# EAGLE design stellariscope (EAGLE 6.3)
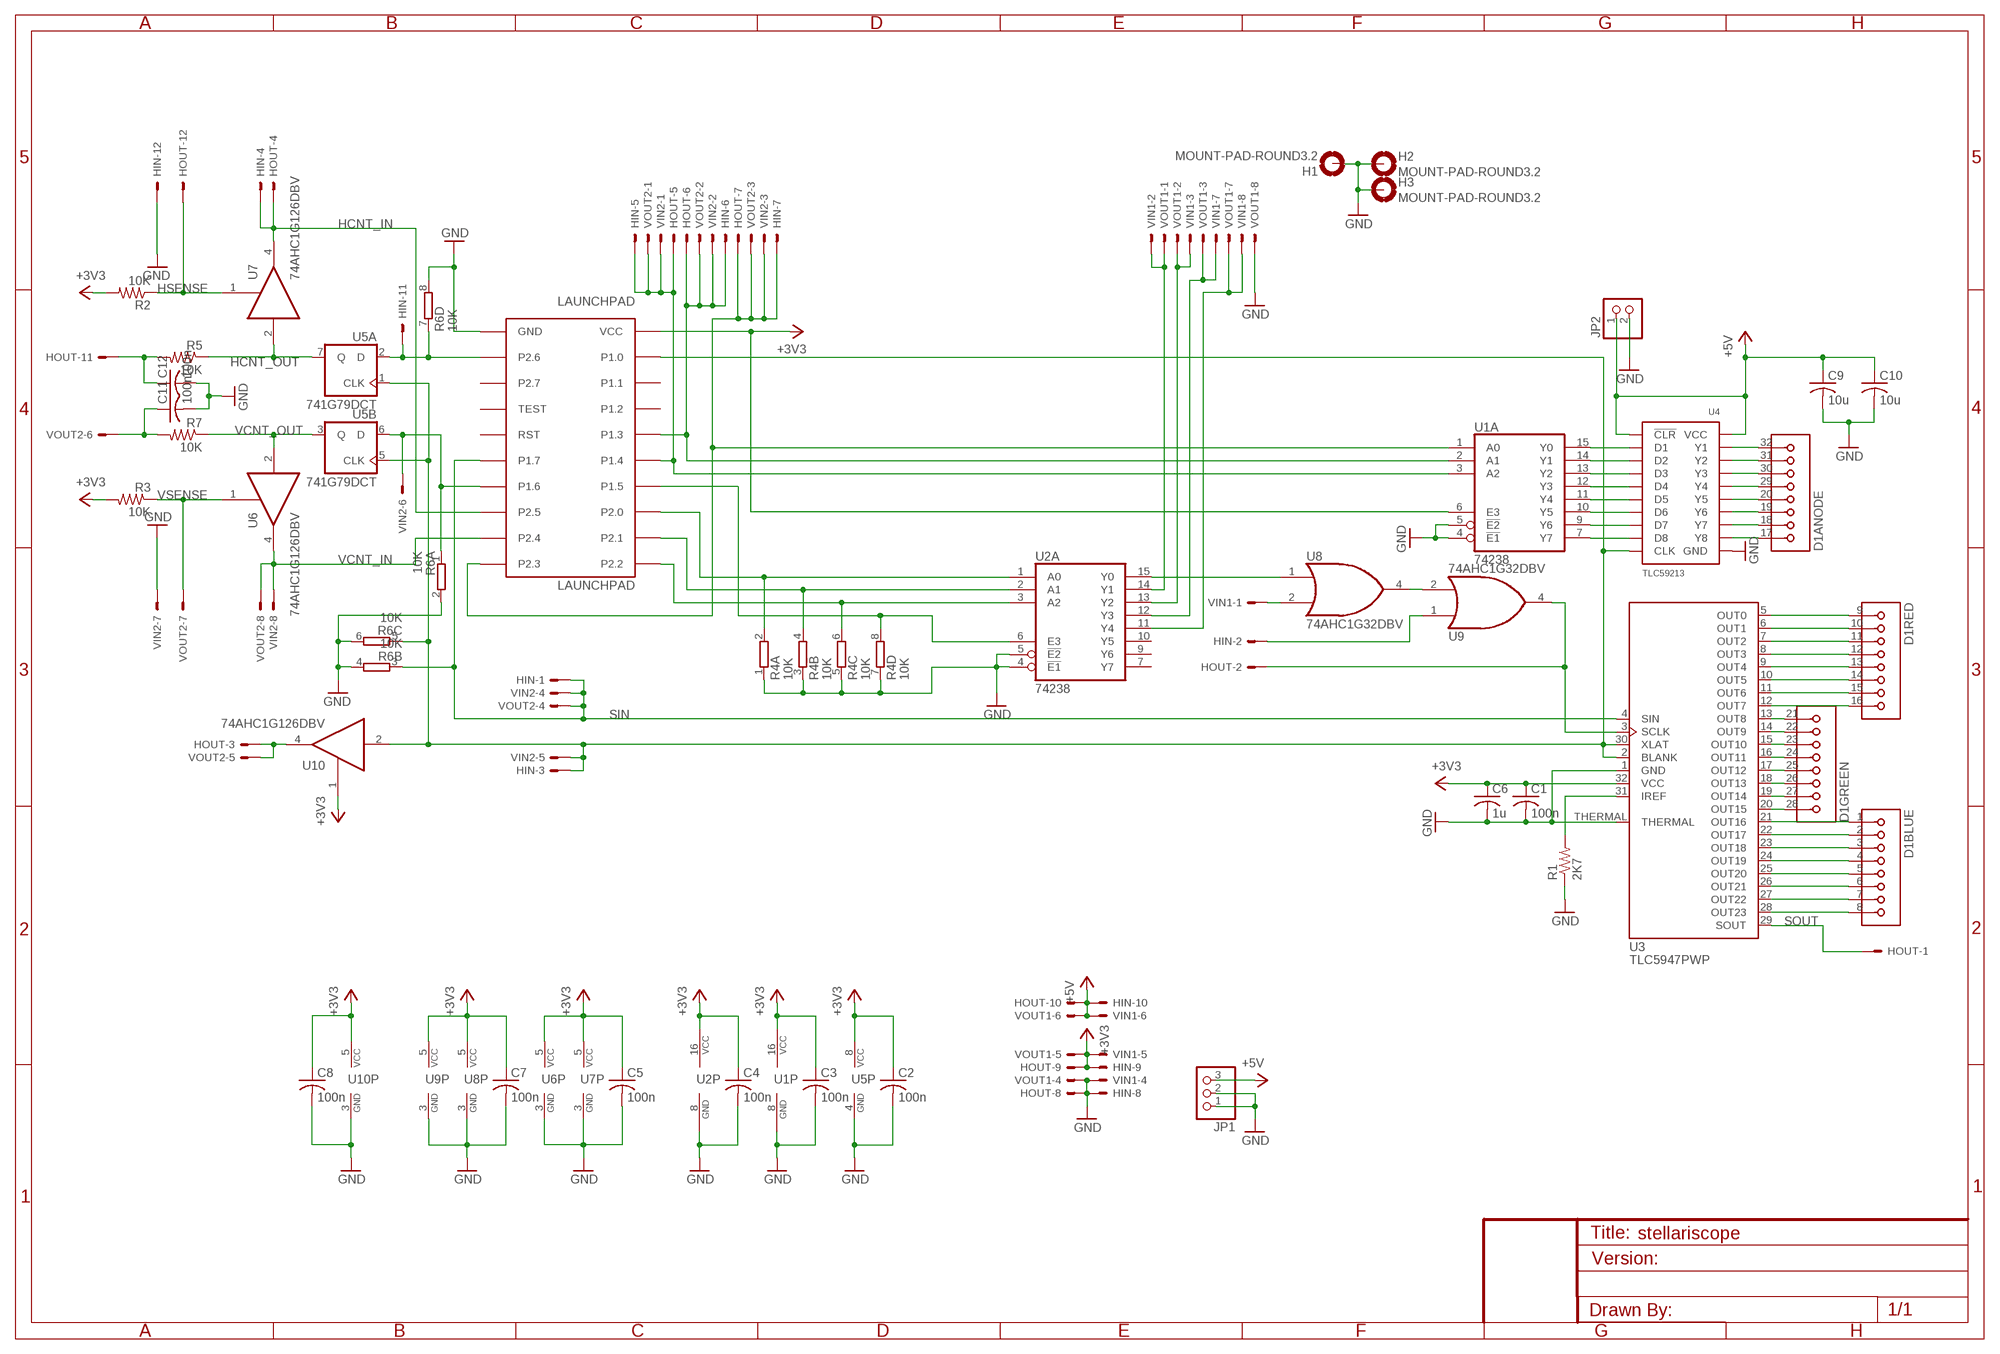
[diagram p0: schematic, sheet 1]

## Parts
C1  100n  C-USC0603  [C0603]
C2  100n  C-USC0603  [C0603]
C3  100n  C-USC0603  [C0603]
C4  100n  C-USC0603  [C0603]
C5  100n  C-USC0603  [C0603]
C6  1u  C-USC0603  [C0603]
C7  100n  C-USC0603  [C0603]
C8  100n  C-USC0603  [C0603]
C9  10u  C-USC1210  [C1210]
C10  10u  C-USC1210  [C1210]
C11  100n  C-USC0603  [C0603]
C12  100n  C-USC0603  [C0603]
D1  60MM-8X8-RGB-LED-ARRAY  [60MM-8X8-RGB-MATRIX]
H1  MOUNT-PAD-ROUND3.2  [3,2-PAD]
H2  MOUNT-PAD-ROUND3.2  [3,2-PAD]
H3  MOUNT-PAD-ROUND3.2  [3,2-PAD]
HIN  87760-121  [87760-121]
HOUT  87264-125  [87264-125]
JP1  PINHD-1X3  [1X03]
JP2  PINHD-1X2_2.54-90°  [1X02/90]
LAUNCHPAD  LAUNCHPAD  [LAUNCHPAD]
R1  2K7  R-US_R0603  [R0603]
R2  10K  R-US_R0603  [R0603]
R3  10K  R-US_R0603  [R0603]
R4  10K  4R-NCTS742C083  [CTS742C083-RES]
R5  10K  R-US_R0603  [R0603]
R6  10K  4R-NCTS742C083  [CTS742C083-RES]
R7  10K  R-US_R0603  [R0603]
U1  74238  [TSSOP16]
U2  74238  [TSSOP16]
U3  TLC5947PWP  [HTSSOP32-PWP]
U4  TLC59213  [TSSOP20]
U5  741G79DCT  [DCT_R-PDSO-G8]
U6  74AHC1G126DBV  [SOT23-5]
U7  74AHC1G126DBV  [SOT23-5]
U8  74AHC1G32DBV  [SOT23-5]
U9  74AHC1G32DBV  [SOT23-5]
U10  74AHC1G126DBV  [SOT23-5]
VIN1  87760-081  [87760-081]
VIN2  87760-081  [87760-081]
VOUT1  87264-085  [87264-085]
VOUT2  87264-085  [87264-085]

## Nets
+3V3: C1.1 C2.1 C3.1 C4.1 C5.1 C6.1 C7.1 C8.1 HIN.10 HOUT.9 LAUNCHPAD.VCC R2.2 R3.2 U1.6(A:E3) U1.16(P:VCC) U2.16(P:VCC) U3.32(VCC) U5.8(P:VCC) U6.5(VCC) U7.5(VCC) U8.5(VCC) U9.5(VCC) U10.1(OE) U10.5(VCC) VIN1.5 VOUT1.5
+5V: C9.1 C10.1 HIN.9 HOUT.10 JP1.3 JP2.1 U4.1(!CLR!) U4.20(VCC) VIN1.6 VOUT1.6
D1: U1.15(A:Y0) U4.2(D1)
D2: U1.14(A:Y1) U4.3(D2)
D3: U1.13(A:Y2) U4.4(D3)
D4: U1.12(A:Y3) U4.5(D4)
D5: U1.11(A:Y4) U4.6(D5)
D6: U1.10(A:Y5) U4.7(D6)
D7: U1.9(A:Y6) U4.8(D7)
D8: U1.7(A:Y7) U4.9(D8)
GND: C1.2 C2.2 C3.2 C4.2 C5.2 C6.2 C7.2 C8.2 C9.2 C10.2 C11.2 C12.2 H1.B3,2(MOUNT) H2.B3,2(MOUNT) H3.B3,2(MOUNT) HIN.8 HIN.12 HOUT.8 JP1.1 JP1.2 JP2.2 LAUNCHPAD.GND R1.1 R4.1 R4.3 R4.5 R4.7 R6.2 R6.4 R6.6 R6.8 U1.4(A:!E1!) U1.5(A:!E2!) U1.8(P:GND) U2.4(A:!E1!) U2.5(A:!E2!) U2.8(P:GND) U3.1(GND) U3.THERMAL U4.11(GND) U5.4(P:GND) U6.3(GND) U7.3(GND) U8.3(GND) U9.3(GND) U10.3(GND) VIN1.4 VIN2.7 VOUT1.4 VOUT1.8
HCNT_IN: HIN.4 HOUT.4 LAUNCHPAD.P2.5 U7.4(O)
HCNT_OUT: R5.1 U5.7(A:Q) U7.2(I)
HSENSE: HOUT.12 R2.1 U7.1(OE)
N$1: D1.9 U3.5(OUT0)
N$2: D1.10 U3.6(OUT1)
N$3: D1.11 U3.7(OUT2)
N$4: D1.12 U3.8(OUT3)
N$5: D1.13 U3.9(OUT4)
N$6: D1.14 U3.10(OUT5)
N$7: D1.15 U3.11(OUT6)
N$8: D1.16 U3.12(OUT7)
N$9: D1.28 U3.20(OUT15)
N$10: D1.27 U3.19(OUT14)
N$11: D1.26 U3.18(OUT13)
N$12: D1.25 U3.17(OUT12)
N$13: D1.24 U3.16(OUT11)
N$14: D1.23 U3.15(OUT10)
N$15: D1.22 U3.14(OUT9)
N$16: D1.21 U3.13(OUT8)
N$17: D1.1 U3.21(OUT16)
N$18: D1.2 U3.22(OUT17)
N$19: D1.3 U3.23(OUT18)
N$20: D1.4 U3.24(OUT19)
N$21: D1.5 U3.25(OUT20)
N$22: D1.6 U3.26(OUT21)
N$23: D1.7 U3.27(OUT22)
N$24: D1.8 U3.28(OUT23)
N$25: HIN.2 U9.1(I0)
N$26: R1.2 U3.31(IREF)
N$27: U2.12(A:Y3) VIN1.7 VOUT1.3
N$28: C12.1 HOUT.11 R5.2
N$29: LAUNCHPAD.P1.5 R4.8 U2.6(A:E3)
N$30: U2.15(A:Y0) U8.1(I0)
N$31: LAUNCHPAD.P2.0 R4.2 U2.1(A:A0)
N$32: LAUNCHPAD.P2.1 R4.4 U2.2(A:A1)
N$33: LAUNCHPAD.P2.2 R4.6 U2.3(A:A2)
N$34: HIN.5 HOUT.5 LAUNCHPAD.P1.4 U1.3(A:A2) VIN2.1 VOUT2.1
N$35: HIN.6 HOUT.6 LAUNCHPAD.P1.3 U1.2(A:A1) VIN2.2 VOUT2.2
N$36: HIN.7 HOUT.7 LAUNCHPAD.P2.3 U1.1(A:A0) VIN2.3 VOUT2.3
N$37: HIN.11 LAUNCHPAD.P2.6 R6.7 U5.2(A:D)
N$38: LAUNCHPAD.P1.6 R6.1 U5.6(B:D) VIN2.6
N$39: U2.14(A:Y1) VIN1.2 VOUT1.1
N$40: U2.13(A:Y2) VIN1.3 VOUT1.2
N$41: U2.11(A:Y4) VIN1.8 VOUT1.7
N$42: C11.1 R7.2 VOUT2.6
N$44: U8.2(I1) VIN1.1
N$47: U8.4(O) U9.2(I1)
N$48: HOUT.2 U3.3(SCLK) U9.4(O)
SIN: HIN.1 LAUNCHPAD.P1.7 R6.3 U3.4(SIN) VIN2.4 VOUT2.4
SOUT: HOUT.1 U3.29(SOUT)
VCNT_IN: LAUNCHPAD.P2.4 U6.4(O) VIN2.8 VOUT2.8
VCNT_OUT: R7.1 U5.3(B:Q) U6.2(I)
VSENSE: R3.1 U6.1(OE) VOUT2.7
XLAT: HIN.3 LAUNCHPAD.P1.0 R6.5 U3.2(BLANK) U3.30(XLAT) U4.10(CLK) U5.1(A:CLK) U5.5(B:CLK) U10.2(I) VIN2.5
XLAT_OUT: HOUT.3 U10.4(O) VOUT2.5
Y1: D1.32 U4.19(Y1)
Y2: D1.31 U4.18(Y2)
Y3: D1.30 U4.17(Y3)
Y4: D1.29 U4.16(Y4)
Y5: D1.20 U4.15(Y5)
Y6: D1.19 U4.14(Y6)
Y7: D1.18 U4.13(Y7)
Y8: D1.17 U4.12(Y8)
Unconnected: LAUNCHPAD.P1.1 LAUNCHPAD.P1.2 LAUNCHPAD.P2.7 LAUNCHPAD.RST LAUNCHPAD.TEST U2.7(A:Y7) U2.9(A:Y6) U2.10(A:Y5)

## Library data of the parts
C1-C5 C7 C8 C11 C12 = resistor:C-US: CAPACITOR, American symbol; PARTNO: CC0603KRX7R9BB104
C6 = resistor:C-US: CAPACITOR, American symbol; PARTNO: C1608X5R1E105M
C9 C10 = resistor:C-US: CAPACITOR, American symbol; PARTNO: C3216X5R1E106M
D1 = logos-diodes:60MM-8X8-RGB-LED-ARRAY; BOM: EXCLUDE; PARTNO: *
H1-H3 = holes:MOUNT-PAD-ROUND: MOUNTING PAD, round; BOM: EXCLUDE
HIN = con-milligrid:87760-121; PARTNO: 87760-121
HOUT = con-milligrid:87264-125; PARTNO: 87264-125
JP1 = pinhead:PINHD-1X3: PIN HEADER; DNP: T; PARTNO: *
JP2 = pinhead-1:PINHD-1X2: PIN HEADER; PARTNO: *
LAUNCHPAD = TI_launchpad:LAUNCHPAD: MSP-EXP430G2 LaunchPad Booster Pack layouts. LAUNCHPAD: Full-size board LAUNCHPAD-50MM: 50x50mm board covering the button area LAUNCHPAD-50MM-LEFT: 50x50mm board leaving the button area open. Tall LaunchPad components marked on Reference for reference.; BOM: EXCLUDE
R1 = resistor:R-US_: RESISTOR, American symbol; PARTNO: RMCF0603FT2K70
R2 R3 R5 R7 = resistor:R-US_: RESISTOR, American symbol; PARTNO: RMCF0603FT10K0
R4 R6 = res-cap-arrays:4R-N: Array Chip Resistor Source: RS Component / Phycomp; PARTNO: 742C083103JPTR
U1 U2 = ti-stuff:74*238; PARTNO: CD74HC238PWR
U3 = logos-led-drivers:TLC5947: 24-channel LED sink driver with dot correction and grayscale PWM Has internal 4 MHz internal PWM clock. 30mA sink capability Made by Texas Instruments Drawn by Pierce Nichols; PARTNO: TLC5947DAP
U4 = logos-led-drivers:TLC59213; PARTNO: TLC59213IPWR
U5 = 74xx-little-us:74*1G79: Single Positive-Edge-Triggered D-Type Flip-Flop Source: http://focus.ti.com/lit/ds/symlink/sn74lvc2g79.pdf; PARTNO: SN74LVC2G79DCTR
U6 U7 U10 = 74xx-little-us:74*1G126: Single Bus Buffer Gate With 3-State Outputs; PARTNO: SN74LVC1G126DBVR
U8 U9 = 74xx-little-us:74*1G32: 2-input OR gate; PARTNO: SN74LVC1G32QDBVRQ1
VIN1 VIN2 = con-milligrid:87760-081; PARTNO: 87760-081
VOUT1 VOUT2 = con-milligrid:87264-085; PARTNO: 87264-085

## Board
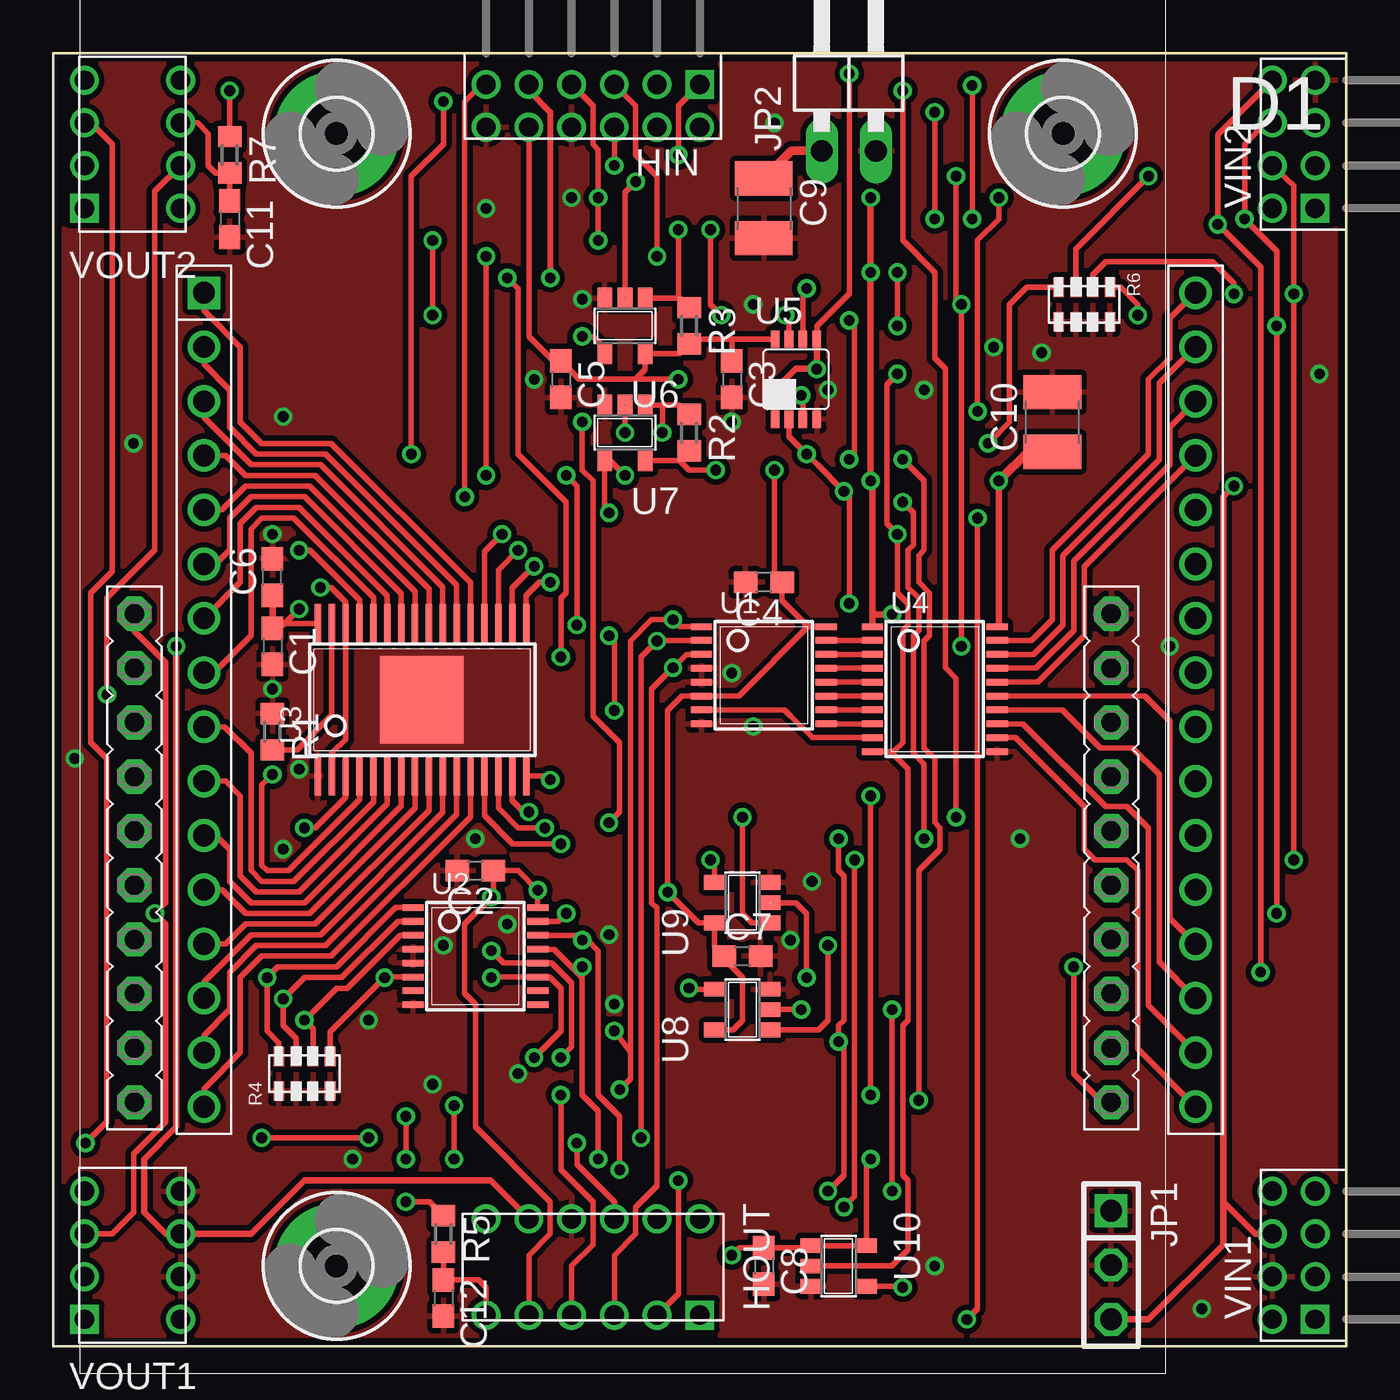
[diagram p1: board, top side]
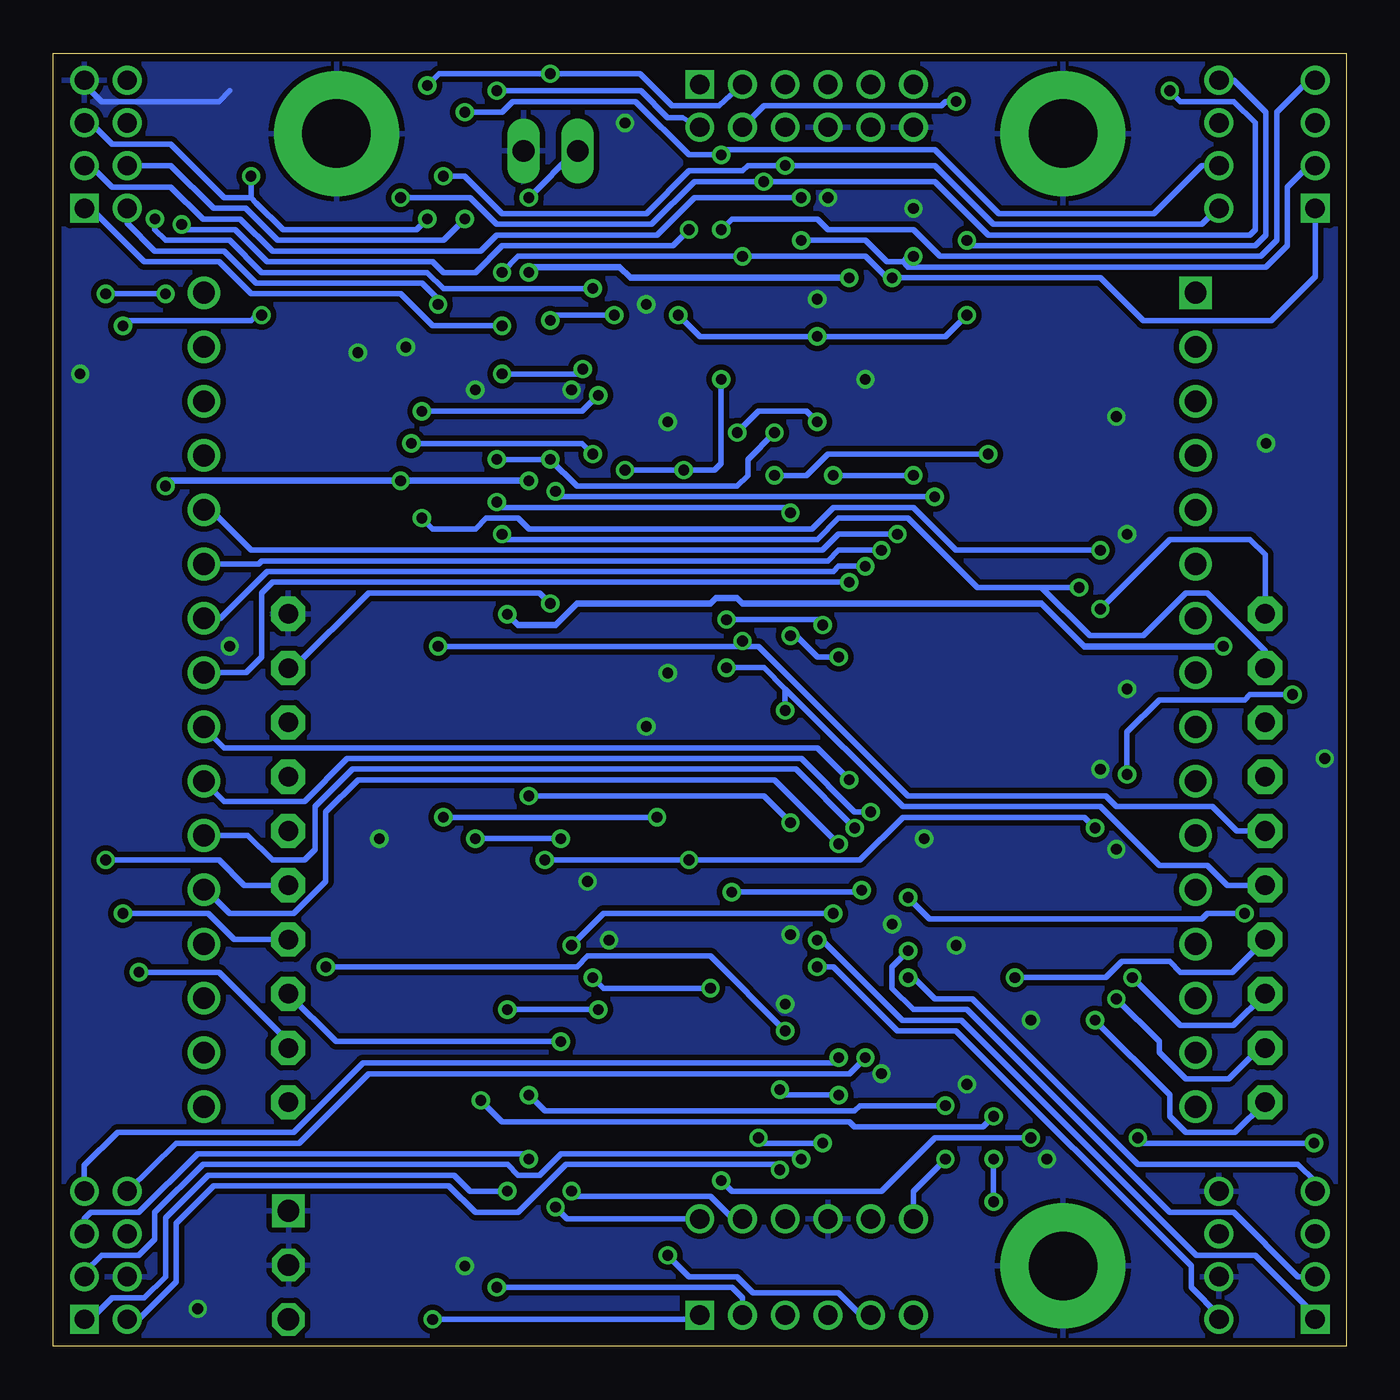
[diagram p2: board, bottom side, seen from below]

Size 60.5 x 60.5 mm. Coordinates in mm from the lower left corner, seen from the top.
Outline: 0,0 60.5,0 60.5,60.5 0,60.5 0,0
Copper layers (1*16): Top 0.0356mm / dielectric 1.5011mm / Bottom 0.0356mm
Design rules "LaenPCBOrder": minimum track width 6mil, minimum drill 13mil, track to track 6mil, track to pad 6mil, pad to pad 6mil, via to via 6mil, smd to smd 6mil, copper to edge 15mil, drill to drill 6mil, minimum pad ring 7mil, minimum via ring 7mil, stop-mask expansion 4mil, vias tented up to drill 0mil, thermal gap 10mil

### Footprints (pad centres in the part's own frame; a part is rotated, then mirrored left to right if it is on the bottom)
C0603 = smd 1.1 x 1: 1 -0.85,0; 2 0.85,0
C1210 = smd 1.6 x 2.7: 1 -1.4,0; 2 1.4,0
60MM-8X8-RGB-MATRIX = drill 1.016 square: 1 -23.2,19.05 | drill 1.016: 2 -23.2,16.51; 3 -23.2,13.97; 4 -23.2,11.43; 5 -23.2,8.89; 6 -23.2,6.35; 7 -23.2,3.81; 8 -23.2,1.27; 9 -23.2,-1.27; 10 -23.2,-3.81; 11 -23.2,-6.35; 12 -23.2,-8.89; 13 -23.2,-11.43; 14 -23.2,-13.97; 15 -23.2,-16.51; 16 -23.2,-19.05; 17 23.2,-19.05; 18 23.2,-16.51; 19 23.2,-13.97; 20 23.2,-11.43; 21 23.2,-8.89; 22 23.2,-6.35; 23 23.2,-3.81; 24 23.2,-1.27; 25 23.2,1.27; 26 23.2,3.81; 27 23.2,6.35; 28 23.2,8.89; 29 23.2,11.43; 30 23.2,13.97; 31 23.2,16.51; 32 23.2,19.05
3,2-PAD = drill 3.2 pad 5.842: B3,2 0,0
87760-121 = drill 0.9 square: 1 -1,5 | drill 0.9: 2 1,5; 3 -1,3; 4 1,3; 5 -1,1; 6 1,1; 7 -1,-1; 8 1,-1; 9 -1,-3; 10 1,-3; 11 -1,-5; 12 1,-5
87264-125 = drill 0.9 square: 1 2.25,5 | drill 0.9: 2 -2.25,5; 3 2.25,3; 4 -2.25,3; 5 2.25,1; 6 -2.25,1; 7 2.25,-1; 8 -2.25,-1; 9 2.25,-3; 10 -2.25,-3; 11 2.25,-5; 12 -2.25,-5
1X03 = drill 1.016 square: 1 -2.54,0 | drill 1.016 octagon: 2 0,0; 3 2.54,0
1X02/90 = drill 1.016 long: 1 -2.54,-3.81; 2 0,-3.81
LAUNCHPAD = drill 0.914 pad 1.6 octagon: GND 30.48,48.26; P1.0 33.02,2.54; P1.1 35.56,2.54; P1.2 38.1,2.54; P1.3 40.64,2.54; P1.4 43.18,2.54; P1.5 45.72,2.54; P1.6 45.72,48.26; P1.7 43.18,48.26; P2.0 48.26,2.54; P2.1 50.8,2.54; P2.2 53.34,2.54; P2.3 53.34,48.26; P2.4 50.8,48.26; P2.5 48.26,48.26; P2.6 33.02,48.26; P2.7 35.56,48.26; RST 40.64,48.26; TEST 38.1,48.26; VCC 30.48,2.54
R0603 = smd 1 x 1.1: 1 -0.85,0; 2 0.85,0
CTS742C083-RES = smd 0.9 x 0.5: 1 -0.8,1.2; 2 0.8,1.2; 3 -0.8,0.4; 4 0.8,0.4; 5 -0.8,-0.4; 6 0.8,-0.4; 7 -0.8,-1.2; 8 0.8,-1.2
TSSOP16 = smd 0.305 x 0.991: 1 -2.275,-2.918; 2 -1.625,-2.918; 3 -0.975,-2.918; 4 -0.325,-2.918; 5 0.325,-2.918; 6 0.975,-2.918; 7 1.625,-2.918; 8 2.275,-2.918; 9 2.275,2.918; 10 1.625,2.918; 11 0.975,2.918; 12 0.325,2.918; 13 -0.325,2.918; 14 -0.975,2.918; 15 -1.625,2.918; 16 -2.275,2.918
HTSSOP32-PWP = smd 0.3 x 1.8: 1 -4.875,-3.575; 2 -4.225,-3.575; 3 -3.575,-3.575; 4 -2.925,-3.575; 5 -2.275,-3.575; 6 -1.625,-3.575; 7 -0.975,-3.575; 8 -0.325,-3.575; 9 0.325,-3.575; 10 0.975,-3.575; 11 1.625,-3.575; 12 2.275,-3.575; 13 2.925,-3.575; 14 3.575,-3.575; 15 4.225,-3.575; 16 4.875,-3.575; 17 4.875,3.575; 18 4.225,3.575; 19 3.575,3.575; 20 2.925,3.575; 21 2.275,3.575; 22 1.625,3.575; 23 0.975,3.575; 24 0.325,3.575; 25 -0.325,3.575; 26 -0.975,3.575; 27 -1.625,3.575; 28 -2.275,3.575; 29 -2.925,3.575; 30 -3.575,3.575; 31 -4.225,3.575; 32 -4.875,3.575 | smd 3.91 x 4.11: THERMAL 0,0
TSSOP20 = smd 0.305 x 0.991: 1 -2.925,-2.918; 2 -2.275,-2.918; 3 -1.625,-2.918; 4 -0.975,-2.918; 5 -0.325,-2.918; 6 0.325,-2.918; 7 0.975,-2.918; 8 1.625,-2.918; 9 2.275,-2.918; 10 2.925,-2.918; 11 2.925,2.918; 12 2.275,2.918; 13 1.625,2.918; 14 0.975,2.918; 15 0.325,2.918; 16 -0.325,2.918; 17 -0.975,2.918; 18 -1.625,2.918; 19 -2.275,2.918; 20 -2.925,2.918
DCT_R-PDSO-G8 = smd 0.4 x 0.8: 1 -0.975,-1.875; 2 -0.325,-1.875; 3 0.325,-1.875; 4 0.975,-1.875; 5 0.975,1.875; 6 0.325,1.875; 7 -0.325,1.875; 8 -0.975,1.875
SOT23-5 = smd 0.69 x 0.99: 1 -0.95,-1.29; 2 0,-1.29; 3 0.95,-1.29; 4 0.95,1.3; 5 -0.95,1.3
87760-081 = drill 0.9 square: 1 -1,3 | drill 0.9: 2 1,3; 3 -1,1; 4 1,1; 5 -1,-1; 6 1,-1; 7 -1,-3; 8 1,-3
87264-085 = drill 0.9 square: 1 2.25,3 | drill 0.9: 2 -2.25,3; 3 2.25,1; 4 -2.25,1; 5 2.25,-1; 6 -2.25,-1; 7 2.25,-3; 8 -2.25,-3

### Placement (x,y rotation side)
C1  10.25,32.75 270 top
C2  19.75,22.25 180 top
C3  31.75,45.25 270 top
C4  33.25,35.75 180 top
C5  23.75,45.25 270 top
C6  10.25,36 90 top
C7  32.25,18.25 0 top
C8  33.25,3.75 270 top
C9  33.25,53.25 270 top
C10  46.75,43.25 90 top
C11  8.25,52.75 270 top
C12  18.25,2.25 270 top
D1  30.25,30.25 0 top
H1  13.25,56.75 0 top
H2  47.25,56.75 0 top
H3  13.25,3.75 0 top
HIN  25.25,58.05 270 top
HOUT  25.25,3.7 270 top
JP1  49.5,3.79 270 top
JP2  38.5,59.75 0 top
LAUNCHPAD  1.25,64.75 270 top
R1  10.25,28.75 270 top
R2  29.75,42.75 270 top
R3  29.75,47.75 270 top
R4  11.75,12.75 90 top
R5  18.25,5.25 270 top
R6  48.25,48.75 270 top
R7  8.25,55.75 270 top
U1  33.25,31.4 270 top
U2  19.75,18.25 270 top
U3  17.25,30.25 0 top
U4  41.25,30.75 270 top
U5  34.75,45.25 0 top
U6  26.75,47.75 180 top
U7  26.75,42.75 180 top
U8  32.25,15.75 90 top
U9  32.25,20.75 90 top
U10  36.75,3.75 270 top
VIN1  58.05,4.25 180 top
VIN2  58.05,56.25 180 top
VOUT1  3.7,4.25 180 top
VOUT2  3.7,56.25 180 top

### Tracks (layer width: path | path; a pad name or v marks a point on that pad's centre or on a via)
+3V3  (via drill 0.5)
  Top 0.254: v38.25,8.75 38.05,8.55 U10.5 U10.1 35.36,4.6 C8.1 32.1,4.6 v31.75,4.25 | U8.5 31.8,14.8 32.25,15.25 32.25,17.25 31.4,18.1 C7.1 30.95,18.7 U9.5 30.2,19.8 v28.75,21.25 28.75,29.75 29.43,30.43 U1.6 32.08,30.43 35.33,33.67 | U2.16 v22.67,21.33 21.75,22.25 C2.1 20.6,21.1 v20.5,21 19.25,19.75 19.25,16.5 19.75,16 19.75,10.25 23.25,6.75 23.25,5.25 22.25,4.25 HOUT.9 | LAUNCHPAD.VCC 3.79,33.46 5.25,32 5.25,20.75 v4.75,20.25 5.25,19.75 5.25,10.5 3.75,9 3.75,6.25 2.75,5.25 VOUT1.5 | HIN.10 22.25,47.25 23.4,46.1 C5.1 24.6,45.25 27.25,45.25 | 27.25,45.25 27.7,45.7 U6.5 29.3,46.45 R3.2 29.98,47.12 31.75,47.12 | U5.8 31.75,47.12 | C3.1 31.75,47.12 | U7.5 29.3,41.45 | 29.3,41.45 R2.2 | 35.33,33.67 34.1,34.9 C4.1 33.75,36.1 v33.75,41 | U1.16 35.33,33.67 | 27.25,45.25 v29.25,45.25 | 29.3,41.45 29.75,41 v31,41 | U3.32 10.47,33.83 C1.1 10.35,33.6 10.5,33.75 10.75,33.75 v11.5,34.5
  Top 0.305: C6.1 C1.1
  Bottom 0.254: VIN1.5 59.05,5.95 58.75,6.25 56.5,6.25 53.75,9 38.5,9 v38.25,8.75 | v4.75,20.25 6.5,20.25 6.75,20 19.5,20 v20.5,21 | v33.75,41 v31,41 29.55,41 29.25,41.3 v29.25,45.25 | v28.75,21.25 22.75,21.25 v22.67,21.33 | HOUT.9 22.7,1.45 23.75,2.5 27.75,2.5 28.5,3.25 30.75,3.25 v31.75,4.25 | v11.5,34.5 8.25,37.75 4.5,37.75 3.79,37.04 LAUNCHPAD.VCC
+5V  (via drill 0.5)
  Top 0.29: 23.25,57.75 v23.25,50
  Top 0.305: VIN1.6 56.25,5.25 54.75,6.75 | 54.75,6.75 54.75,39.75 v55.25,40.25 | v44.25,40.5 44.25,33.76 U4.20 | U4.1 38.33,34.25 | 38.33,34.25 38.33,40.42 v38.25,40.5 v38.25,50.25 v38.25,53.75 | v5.75,32.75 5.75,10.25 4.25,8.75 4.25,6.25 5.25,5.25 VOUT1.6 9.25,5.25 11.75,7.75 20.45,7.75 HOUT.10 | HIN.9 22.25,58.75 23.25,57.75 | v39.25,34.25 38.33,34.25 | JP1.3 51.25,1.25 54.75,4.75 54.75,6.75
  Top 0.406: 44.25,40.35 v44.25,40.5 45.6,41.85 C10.1 | JP2.1 34.54,55.94 C9.1
  Bottom 0.305: v55.25,40.25 55,40.5 v44.25,40.5 v38.25,40.5 | v5.75,32.75 12.25,32.75 14.25,34.75 28.25,34.75 28.5,35 29.5,35 29.75,34.75 36,34.75 37,33.75 38.75,33.75 v39.25,34.25 | v23.25,50 33.5,50 34,50.5 38,50.5 v38.25,50.25 | JP2.1 36.06,55.94 v38.25,53.75
D1
  Top 0.254: U1.15 U4.2
D2
  Top 0.254: U1.14 U4.3
D3
  Top 0.254: U1.13 U4.4
D4
  Top 0.254: U1.12 U4.5
D5
  Top 0.254: U1.11 U4.6
D6
  Top 0.254: U1.10 U4.7
D7
  Top 0.254: U1.9 U4.8
D8
  Top 0.254: U4.9 35.52,28.48 34.5,29.5 34.25,29.75 34.23,29.77 U1.7
GND  (via drill 0.5)
  Bottom 0.254: VIN2.7 59.05,59.05 58.25,58.25 52.75,58.25 52.25,58.75
  other vias: 10.25,38 10.25,30.75 1,27.5 19.75,23.75 34.5,19 11.5,27 24.75,49 36.25,44.75 22.5,45.25 20.25,53.25 24.25,53.75 10.75,23.25 10.75,43.5 26,19.25 35.5,21.75 31.75,43.25 3.75,42.25 31.75,31.5 32.75,29 14,8.75 14.75,15.25 17.75,12.25 21.75,12.75 21.25,19.75 18.25,18.75 53.75,1.75 52.25,32.75 45.25,23.75 26.25,16 59.25,45.5 46.25,46.5 41.25,3.75 32.75,48.75 33.75,57.25 40.75,44.75 44,46.75
  pour Top (isolate 0.254): 0.25,60.25 60.25,60.25 60.25,0.25 0.25,0.25
  pour Bottom (isolate 0.254): 0.25,60.25 60.25,60.25 60.25,0.25 0.25,0.25
HCNT_IN  (via drill 0.5)
  Top 0.254: v36.25,7.25 37,8 37,14 v36.75,14.25 36.75,15 37,15.25 37,22 36.75,22.25 v36.75,23.75 | v40.75,23.75 40.75,27.25 40.25,27.75 40.25,33.25 40.5,33.5 40.5,35 40,35.5 40,37.25 40.25,37.5 40.25,39 v39.75,39.5 | v26,39 25.8,39.2 U7.4 26.05,41.45 v26.75,40.75 | v16.75,41.75 16.75,54.75 18.25,56.25 v18.25,58.25
  Bottom 0.254: HOUT.4 28.7,5.95 29.75,7 36,7 v36.25,7.25 | v36.75,14.25 47.27,14.25 LAUNCHPAD.P2.5 | v36.75,23.75 v40.75,23.75 | v39.75,39.5 39.5,39.25 26.25,39.25 v26,39 | v26.75,40.75 25.25,40.75 24.25,41.75 v16.75,41.75 | v18.25,58.25 18.75,58.25 18.95,58.05 27.25,58.05 HIN.4
HCNT_OUT  (via drill 0.5)
  Top 0.254: v16.5,8.75 v16.5,10.75 | v40.5,11.5 40.5,22.25 41.5,23.25 41.5,24.25 41.25,24.5 41.25,27.5 40.75,28 40.75,33 41,33.25 41,35.25 40.5,35.75 40.5,37 40.75,37.25 40.75,40.5 v39.75,41.5 | v26.75,42.75 U7.2 | U5.7 34.42,48.08 v34.25,48.25 | v37.25,48 37.5,47.75 37.5,41.75 v37.25,41.5 | v16.5,6.75 17.6,6.75 R5.1
  Bottom 0.254: v16.5,6.75 v16.5,8.75 | v16.5,10.75 17,10.25 23,10.25 23.25,10.5 39.5,10.5 v40.5,11.5 | v39.75,41.5 v37.25,41.5 36,40.25 28.5,40.25 28,40.75 28,41.5 v26.75,42.75 | v34.25,48.25 37,48.25 v37.25,48
HSENSE  (via drill 0.5)
  Top 0.254: U7.1 28.5,44.04 | 28.5,44.04 29.31,44.04 R2.1 | v18.75,8.75 v18.75,11.25 | v38.25,11.75 v38.25,25.75 | v26,24.5 26.5,25 26.5,28.25 25.25,29.5 25.25,40.5 24.75,41 v24.75,43.25 | v28.5,42.75 28.5,44.04
  Bottom 0.254: HOUT.12 20.25,7.25 v18.75,8.75 | v18.75,11.25 22.75,11.25 23,11 37.5,11 v38.25,11.75 | v38.25,25.75 27.25,25.75 v26,24.5 | v24.75,43.25 25.25,43.75 27.5,43.75 v28.5,42.75
N$1
  Top 0.254: D1.9 8.02,28.98 9.25,27.75 9.25,22.25 9.75,21.75 11.25,21.75 14.97,25.48 U3.5
N$2
  Top 0.254: D1.10 8.06,26.44 8.75,25.75 8.75,22 9.5,21.25 11.5,21.25 15.62,25.38 U3.6
N$3
  Top 0.254: D1.11 7.6,23.9 8.25,23.25 8.25,21.75 9.25,20.75 11.75,20.75 16.27,25.27 U3.7
N$4
  Top 0.254: D1.12 7.89,21.36 9,20.25 12,20.25 16.93,25.18 U3.8
N$5
  Top 0.254: D1.13 8.07,18.82 9,19.75 12.25,19.75 17.57,25.07 U3.9
N$6
  Top 0.254: D1.14 7.05,17.05 9.25,19.25 12.5,19.25 18.23,24.98 U3.10
N$7
  Top 0.254: D1.15 7.05,14.55 8.25,15.75 8.25,17.5 9.5,18.75 12.75,18.75 18.88,24.88 U3.11
N$8
  Top 0.254: D1.16 7.05,12.05 8.75,13.75 8.75,17.25 9.75,18.25 13,18.25 19.52,24.77 U3.12
N$9  (via drill 0.5)
  Top 0.254: v21,38 20.18,37.17 U3.20
  Bottom 0.254: D1.28 53.14,39.14 51.25,37.25 24.5,37.25 23.75,38 v21,38
N$10  (via drill 0.5)
  Top 0.254: v21.75,37.25 20.82,36.33 U3.19
  Bottom 0.254: D1.27 50.9,36.6 50.75,36.75 24.25,36.75 23.75,37.25 v21.75,37.25
N$11  (via drill 0.5)
  Top 0.254: v22.5,36.5 21.48,35.48 U3.18
  Bottom 0.254: D1.26 52.69,34.06 50.5,36.25 24,36.25 23.75,36.5 v22.5,36.5
N$12  (via drill 0.5)
  Top 0.254: v23.25,35.75 22.75,35.75 22.12,35.12 U3.17
  Bottom 0.254: D1.25 51.48,31.52 50.75,32.25 50.75,35.25 50.25,35.75 v23.25,35.75
N$13  (via drill 0.5)
  Top 0.254: 23.12,26.62 v23.25,26.5 23.07,26.68 U3.16
  Bottom 0.254: D1.24 53.45,28.95 52.5,28 24.75,28 v23.25,26.5
N$14  (via drill 0.5)
  Top 0.254: v22.25,25 22,25 21.48,25.52 U3.15
  Bottom 0.254: D1.23 52.5,25.5 48.75,25.5 46.75,27.5 25.5,27.5 23,25 v22.25,25
N$15  (via drill 0.5)
  Top 0.254: v23,24.25 21.75,24.25 20.82,25.18 U3.14
  Bottom 0.254: D1.22 51.4,23.9 50.25,22.75 48.75,22.75 48.25,23.25 48.25,25.25 46.5,27 25.75,27 v23,24.25
N$16  (via drill 0.5)
  Top 0.254: v23.75,23.5 21.5,23.5 20.18,24.82 U3.13
  Bottom 0.254: D1.21 53.36,21.36 52.25,20.25 49.25,20.25 47.75,21.75 47.75,25 46.25,26.5 26.75,26.5 v23.75,23.5
N$17
  Top 0.254: D1.1 7.05,48.45 8.75,46.75 8.75,43.25 9.75,42.25 13,42.25 19.52,35.73 U3.21
N$18
  Top 0.254: D1.2 7.05,45.95 8.25,44.75 8.25,43 9.5,41.75 12.75,41.75 18.88,35.62 U3.22
N$19
  Top 0.254: D1.3 7.05,43.45 9.25,41.25 12.5,41.25 18.23,35.52 U3.23
N$20
  Top 0.254: D1.4 8.07,41.68 9,40.75 12.25,40.75 17.57,35.42 U3.24
N$21
  Top 0.254: D1.5 7.89,39.14 9,40.25 12,40.25 16.93,35.33 U3.25
N$22
  Top 0.254: D1.6 7.6,36.6 8.25,37.25 8.25,38.75 9.25,39.75 11.75,39.75 16.27,35.23 U3.26
N$23
  Top 0.254: D1.7 8.75,35.75 8.75,38.5 9.5,39.25 11.5,39.25 15.62,35.12 U3.27
N$24
  Top 0.254: D1.8 7.52,31.52 9.25,33.25 9.25,38.25 9.75,38.75 11.25,38.75 14.97,35.02 U3.28
N$25  (via drill 0.5)
  Top 0.254: U9.1 32.7,19.8 32.25,20.25 v32.25,24.75 | v42.25,24.75 42.25,31.25 41.75,31.75 41.75,45.75 41.25,46.25 41.25,50.25 39.75,51.75 v39.75,58.75
  Bottom 0.254: v32.25,24.75 v42.25,24.75 | HIN.2 31.05,57.5 31.75,57.5 33,58.75 v39.75,58.75
N$26
  Top 0.254: R1.2 11.4,27.9 13.03,29.52 U3.31
N$27  (via drill 0.5)
  Top 0.254: v20.5,18.5 21.07,17.93 U2.12 23.32,17.93 24.25,17 24.25,14 v23.75,13.5
  Bottom 0.254: VIN1.7 59.05,8.45 57.5,10 49.25,10 46,13.25 24,13.25 v23.75,13.5 | v20.5,18.5 21.25,17.75 21.25,16.75 20.25,15.75 17.75,15.75 8.25,6.25 5.25,6.25 2.25,3.25 VOUT1.3
N$28
  Top 0.254: R5.2 C12.1 19.9,3.1 20.25,2.75 HOUT.11
N$29  (via drill 0.5)
  Top 0.254: U2.6 15.53,17.27 v15.5,17.25 12.95,14.7 R4.8
  Bottom 0.254: v15.5,17.25 11.25,17.25 10.5,18 8.25,18 7.75,17.5 5.32,17.5 LAUNCHPAD.P1.5
N$30  (via drill 0.5)
  Top 0.254: U2.15 23.62,19.88 v24,20.25 | v36.25,18.75 36.25,15.25 35.8,14.8 U8.1
  Bottom 0.254: v24,20.25 34.75,20.25 v36.25,18.75
N$31  (via drill 0.5)
  Top 0.254: U2.1 16.02,20.52 13.25,17.75 10.5,17.75 v10,17.25 10,14.75 10.55,14.2 R4.2
  Bottom 0.254: v10,17.25 7.75,15 5.28,15 LAUNCHPAD.P2.0
N$32  (via drill 0.5)
  Top 0.254: U2.2 16.12,19.88 13.5,17.25 11.75,17.25 v10.75,16.25 10.75,15 11.35,14.4 R4.4
  Bottom 0.254: LAUNCHPAD.P2.1 4.05,13.95 5.5,12.5 7.5,12.5 8.75,13.75 8.75,14.25 v10.75,16.25
N$33  (via drill 0.5)
  Top 0.254: U2.3 16.23,19.23 13.75,16.75 13.25,16.75 v11.75,15.25 12.15,14.85 R4.6
  Bottom 0.254: v11.75,15.25 8.25,11.75 8.25,10.75 7.5,10 5.2,10 LAUNCHPAD.P2.2
N$34  (via drill 0.5)
  Top 0.254: U1.3 29.62,32.38 v29,31.75 28,30.75 28,20.75 28.25,20.5 28.25,7.5 27.25,6.5 27.25,5.25 26.25,4.25 HOUT.5 | v26.25,29.75 26.25,33 v26,33.25 | v23.75,32.25 23.75,35 24,35.25 24,39.5 21.75,41.75 21.75,49.5 v21.25,50 | v28.25,51 28.25,54.75 27.25,55.75 27.25,58.05 HIN.5 | v39.5,50.25 v39.5,47.75
  Bottom 0.254: VIN2.1 58.75,53.25 56.25,50.75 52.75,50.75 51.25,49.25 44.25,49.25 42.75,47.75 v39.5,47.75 | LAUNCHPAD.P1.4 5.57,21.57 6.5,22.5 8.75,22.5 11.5,25.25 20.75,25.25 26.25,30.75 | v29,31.75 27.25,31.75 26.25,30.75 | VOUT2.1 1.45,50.05 3.5,48 9.5,48 11.5,50 v21.25,50 21.5,50 22.5,51 v28.25,51 38.75,51 v39.5,50.25 | 26.25,30.75 v26.25,29.75 | v26,33.25 25.75,33.25 24.75,32.25 v23.75,32.25
N$35  (via drill 0.5)
  Top 0.254: U1.2 28.27,33.02 v28.25,33 27.5,32.25 v27.5,9.75 | HIN.6 v26.25,55.25 | v42.25,54.75 42.25,49 v42.5,48.75 v42.5,32.75 | HOUT.6 26.25,6.75 24.5,8.5 v24.5,9.5
  Bottom 0.254: VIN2.2 57.05,52.55 55.75,51.25 52.5,51.25 51,49.75 43.25,49.75 42.25,48.75 v42.5,48.75 | LAUNCHPAD.P1.3 5.11,24.11 6.25,25.25 10.75,25.25 11.25,25.75 20.5,25.75 27.5,32.75 28,32.75 v28.25,33 28.5,32.75 v42.5,32.75 | VOUT2.2 6,53.25 6.75,52.5 16.5,52.5 19.25,55.25 v26.25,55.25 28,55.25 28.25,55 30.75,55 32.75,53 39.5,53 41.25,54.75 v42.25,54.75 | v24.5,9.5 27.25,9.5 v27.5,9.75
N$36  (via drill 0.5)
  Top 0.254: v29,34 29.25,33.75 | U1.1 29.32,33.67 v29,34 | HOUT.7 24.25,3.75 25.25,4.75 25.25,6.75 23.75,8.25 v23.75,11.75 | v26.5,12 27,12.5 27,13.75 | 27,13.75 27,33 28,34 v29,34 | v24.5,33.75 24.5,40.25 v24,40.75 | HIN.7 25.25,58.05 25.25,56.25 25.5,56 v25.5,53.75 v25.5,51.75 | v20.25,40.75 v20.25,51 | LAUNCHPAD.P2.3 49.09,11.41 47.75,12.75 v47.75,17.75 | v26.25,14.75 27,13.75
  Bottom 0.254: VIN2.3 58.75,55.25 57.75,54.25 55,54.25 53.5,52.75 51.75,52.75 50.25,51.25 40.5,51.25 39.75,52 32.25,52 30.5,53.75 v25.5,53.75 | VOUT2.3 1.75,55.25 2.75,54.25 2.75,51.5 3.75,50.5 20.5,50.5 20.75,50.75 | v23.75,11.75 26.25,11.75 v26.5,12 | v24.5,33.75 24.75,34 v29,34 28,34 | 20.75,50.75 21.5,50.75 22.5,51.75 v25.5,51.75 | v24,40.75 v20.25,40.75 | v20.25,51 20.5,51 20.75,50.75 | v47.75,17.75 36,17.75 35.5,18.25 29.75,18.25 v26.25,14.75
N$37  (via drill 0.5)
  Top 0.254: v37.25,34.75 37.25,39.75 v37,40 35.75,41.25 v35.25,41.75 34.42,42.58 U5.2 | HIN.11 20.05,59.05 19.25,58.25 v19.25,39.75 | R6.7 45.55,49.55 44.75,48.75 44.75,43.25 v43.75,42.25
  Bottom 0.254: LAUNCHPAD.P2.6 49.27,31.73 45.75,35.25 37.75,35.25 v37.25,34.75 | v19.25,39.75 36.75,39.75 v37,40 | v43.75,42.25 35.75,42.25 v35.25,41.75
N$38  (via drill 0.5)
  Top 0.254: v57.25,20.25 v57.25,47.75 57.25,49.25 57.25,51.25 v55.75,52.75 55.75,56.25 56.75,57.25 VIN2.6 | U5.6 35.08,49.33 v35.25,49.5 | R6.1 49.95,49.55 50.75,48.75 v50.75,48.25
  Bottom 0.254: LAUNCHPAD.P1.6 52.03,19.03 53.25,20.25 v57.25,20.25 | v55.75,52.75 55.75,52.25 55.25,51.75 52.25,51.75 50.75,50.25 43,50.25 42.25,49.5 v35.25,49.5 | v50.75,48.25 51,48.25 51.25,48 57,48 v57.25,47.75
N$39  (via drill 0.5)
  Top 0.254: U2.14 24.52,19.23 v24.75,19 25,19 25.5,18.5 25.5,11.75 26.5,10.75 v26.5,8.25
  Bottom 0.254: VIN1.2 56.5,1.25 54.75,3 54.75,5.75 53,7.5 42,7.5 40.75,6.25 38.75,6.25 36.5,8.5 26.75,8.5 v26.5,8.25 | VOUT1.1 1.45,1.45 4.25,4.25 7,4.25 18,15.25 20.77,15.25 24.75,19.23 24.52,19.23 v24.75,19
N$40  (via drill 0.5)
  Top 0.254: U2.13 23.43,18.57 24.75,17.25 | 24.75,17.25 24.75,11.75 25.5,11 v25.5,8.75 | v24.75,17.75 24.75,17.25
  Bottom 0.254: VIN1.3 59.05,3.45 58.25,4.25 56.5,4.25 55.75,5 55.75,6.25 53.5,8.5 39.25,8.5 38.75,8 37.75,8 36.75,9 25.75,9 v25.5,8.75 | VOUT1.2 5.95,1.45 7.25,2.75 7.25,3.75 18.25,14.75 21,14.75 24,17.75 v24.75,17.75
N$41  (via drill 0.5)
  Top 0.254: v20.5,17.25 20.52,17.27 U2.11 23.23,17.27 23.75,16.75 23.75,14.75 v22.5,13.5
  Bottom 0.254: VIN1.8 54.75,9.5 49,9.5 45.75,12.75 23.25,12.75 v22.5,13.5 | VOUT1.7 1.45,7.7 2.25,8.5 9.75,8.5 17.5,16.25 19.25,16.25 20.25,17.25 v20.5,17.25
N$42
  Top 0.254: C11.1 R7.2 7.6,54.9 7.25,55.25 7.25,56.75 6.75,57.25 VOUT2.6
N$44  (via drill 0.5)
  Top 0.254: U8.2 v35,15.75 | v39.25,15.75 v39.25,7.25
  Bottom 0.254: VIN1.1 58.75,1.25 57.75,2.25 56.25,2.25 55.25,3.25 55.25,6 53.25,8 41.75,8 41,7.25 v39.25,7.25 | v35,15.75 v39.25,15.75
N$47  (via drill 0.5)
  Top 0.254: U8.4 29.8,16.7 v29.75,16.75 | v35.25,17.25 35.25,20.25 34.75,20.75 U9.2
  Bottom 0.254: v29.75,16.75 34.75,16.75 v35.25,17.25
N$48  (via drill 0.5)
  Top 0.254: U9.4 30.95,22.55 v30.75,22.75 | v11.75,24.25 12.25,24.25 13.68,25.68 U3.3 | v37,6.5 37.5,7 v37.5,22.75
  Bottom 0.254: v11.75,24.25 12.25,24.75 20.75,24.75 22.75,22.75 v30.75,22.75 v37.5,22.75 | HOUT.2 36.45,5.95 v37,6.5
SIN  (via drill 0.5)
  Top 0.254: v58.05,22.75 v58.05,49.25 58.05,54.3 VIN2.4 | U3.4 14.32,25.57 11,22.25 10,22.25 9.75,22.5 9.75,26.25 v10.25,26.75 | v2.5,30.5 2.5,35 4.75,37.25 4.75,54.05 VOUT2.4 | v29.25,55.75 29.25,58.05 HIN.1 | v41.25,57.75 v41.25,52.75 | R6.3 48.65,50.15 49.25,50.75 54.25,50.75 55.25,49.75 v55.25,49.25
  Bottom 0.254: LAUNCHPAD.P1.7 51.57,21.57 52.75,22.75 v58.05,22.75 | VIN2.4 55,55.25 53,53.25 51.5,53.25 50,51.75 42.25,51.75 v41.25,52.75 | v10.25,26.75 10.25,28.75 8.75,30.25 4.75,30.25 4.5,30.5 v2.5,30.5 | VOUT2.4 6.75,55.25 9,53 16.25,53 19.25,56 29,56 v29.25,55.75 30.75,55.75 33.25,58.25 39,58.25 39.5,57.75 v41.25,57.75 | v55.25,49.25 v58.05,49.25
SOUT  (via drill 0.5)
  Top 0.254: U3.29 14.32,34.92 12,37.25 v11.5,37.25 | v43.25,38.75 43.25,1.75 v42.75,1.25
  Bottom 0.254: v11.5,37.25 18.25,37.25 20.25,39.25 24,39.25 25,38.25 38.25,38.25 38.75,38.75 40.25,38.75 40.75,38.25 42.75,38.25 v43.25,38.75 | v42.75,1.25 30.45,1.25 HOUT.1
VCNT_IN  (via drill 0.5)
  Top 0.254: v56.5,17.5 56.5,50.5 v54.5,52.5 54.5,56.7 VIN2.8 | v17.75,51.75 v17.75,48.25 | v24.75,47.25 25.25,47.25 25.8,46.7 U6.4 | v30.75,52.25 30.75,48.75 v31.25,48.25
  Bottom 0.254: LAUNCHPAD.P2.4 49.51,14.26 52.75,17.5 v56.5,17.5 | v54.5,52.5 54.25,52.25 52,52.25 50.5,50.75 42.75,50.75 42.25,50.25 40.75,50.25 39.5,51.5 31.5,51.5 v30.75,52.25 | VOUT2.8 5.25,59.25 3.75,57.75 3.75,52 4.25,51.5 17.5,51.5 v17.75,51.75 | v17.75,48.25 18.75,47.25 v24.75,47.25 30.25,47.25 v31.25,48.25
VCNT_OUT  (via drill 0.5)
  Top 0.254: v27.25,54.5 26.75,54 U6.2 | U5.3 35.08,44.42 v35,44.5 | v43.25,43.75 43.25,51.75 44.25,52.75 v44.25,53.75 | v8.25,58.75 R7.1
  Bottom 0.254: v35,44.5 35.75,43.75 v43.25,43.75 | v44.25,53.75 41,53.75 39.75,52.5 32.5,52.5 30.5,54.5 v27.25,54.5 19.25,54.5 16.75,52 4.5,52 4.25,52.25 4.25,57.25 5.25,58.25 7.75,58.25 v8.25,58.75
VSENSE  (via drill 0.5)
  Top 0.254: U6.1 29.31,49.04 | 29.31,49.04 R3.1 | v29.25,52.25 29.25,49.1 29.31,49.04
  Bottom 0.254: VOUT2.7 1.75,59.25 3.25,57.75 3.25,51.75 4,51 19,51 20.25,52.25 24.25,52.25 24.75,52.75 28.75,52.75 v29.25,52.25
XLAT  (via drill 0.5)
  Top 0.254: U10.2 39.25,3.75 40,4.5 40,7.75 39.75,8 39.75,15 40,15.25 40,27 39.17,27.82 U4.10 39.33,27.82 39.75,28.25 39.75,33.5 40,33.75 40,34.75 39.5,35.25 v39.5,38 39,38.5 39,45 v39.5,45.5 | v12.5,35.5 13,35.5 13.68,34.83 U3.30 13.68,28.4 13.03,27.75 U3.2 | U5.5 35.73,47.73 37.25,49.25 v37.25,59.55 | v43,52.75 v43,59 | R6.5 47.85,51.35 v51.25,54.75
  Top 0.305: U5.1 33.77,44.77 34.75,45.75 35.75,45.75 v35.73,45.73 U5.5
  Bottom 0.254: VIN2.5 58.75,57.25 57.75,56.25 55,56.25 52.5,53.75 51.25,53.75 | LAUNCHPAD.P1.0 3.79,32.54 6.5,35.25 7.5,35.25 9.5,33.25 12,33.25 14.25,35.5 | v39.5,45.5 35.95,45.5 v35.73,45.73 | v12.5,35.5 14.25,35.5 | 14.25,35.5 17.25,35.5 20.5,38.75 23.75,38.75 24.75,37.75 39.25,37.75 v39.5,38 | HIN.3 29.35,58.05 31.55,58.05 33.05,59.55 v37.25,59.55 42.45,59.55 v43,59 | v43,52.75 43.5,52.25 49.75,52.25 51,53.5 51.25,53.75 | v51.25,54.75 51.25,53.75
XLAT_OUT  (via drill 0.5)
  Top 0.254: U10.4 39.7,2.8 v39.75,2.75 | VOUT2.5 1.75,57.25 2.75,56.25 2.75,36.25 1.75,35.25 1.75,28.25 2.5,27.5 2.5,10.5 v1.5,9.5 | v9.75,9.75 v14.75,9.75 | v29.25,7.75 29.25,2.45 HOUT.3
  Bottom 0.254: HOUT.3 28.25,2.25 28.75,2.75 v39.75,2.75 | v1.5,9.5 9.5,9.5 v9.75,9.75 | v14.75,9.75 19.25,9.75 21.75,7.25 28.75,7.25 v29.25,7.75
Y1
  Top 0.254: U4.19 45.77,33.02 46.75,34 46.75,37.25 51.25,41.75 51.25,45.25 52.25,46.25 52.25,48.1 D1.32
Y2
  Top 0.254: U4.18 45.88,32.38 47.25,33.75 47.25,37 51.75,41.5 51.75,45.06 D1.31
Y3
  Top 0.254: U4.17 45.98,31.73 47.75,33.5 47.75,36.75 52.25,41.25 52.25,43.02 D1.30
Y4
  Top 0.254: U4.16 46.08,31.07 48.25,33.25 48.25,36.48 D1.29
Y5
  Top 0.254: U4.15 51.08,30.43 52.25,29.25 52.25,20.02 D1.20
Y6
  Top 0.254: U4.14 47.23,29.77 49,28 50.5,28 51.75,26.75 51.75,17.98 D1.19
Y7
  Top 0.254: U4.13 45.38,29.12 49.25,25.25 50.25,25.25 51.25,24.25 51.25,15.94 D1.18
Y8
  Top 0.254: U4.12 45.02,28.48 48.25,25.25 48.25,23.25 48.75,22.75 50.25,22.75 50.75,22.25 50.75,13.9 D1.17